# EAGLE schematic ramanSpectrometer_contolBoard (EAGLE 6.2)
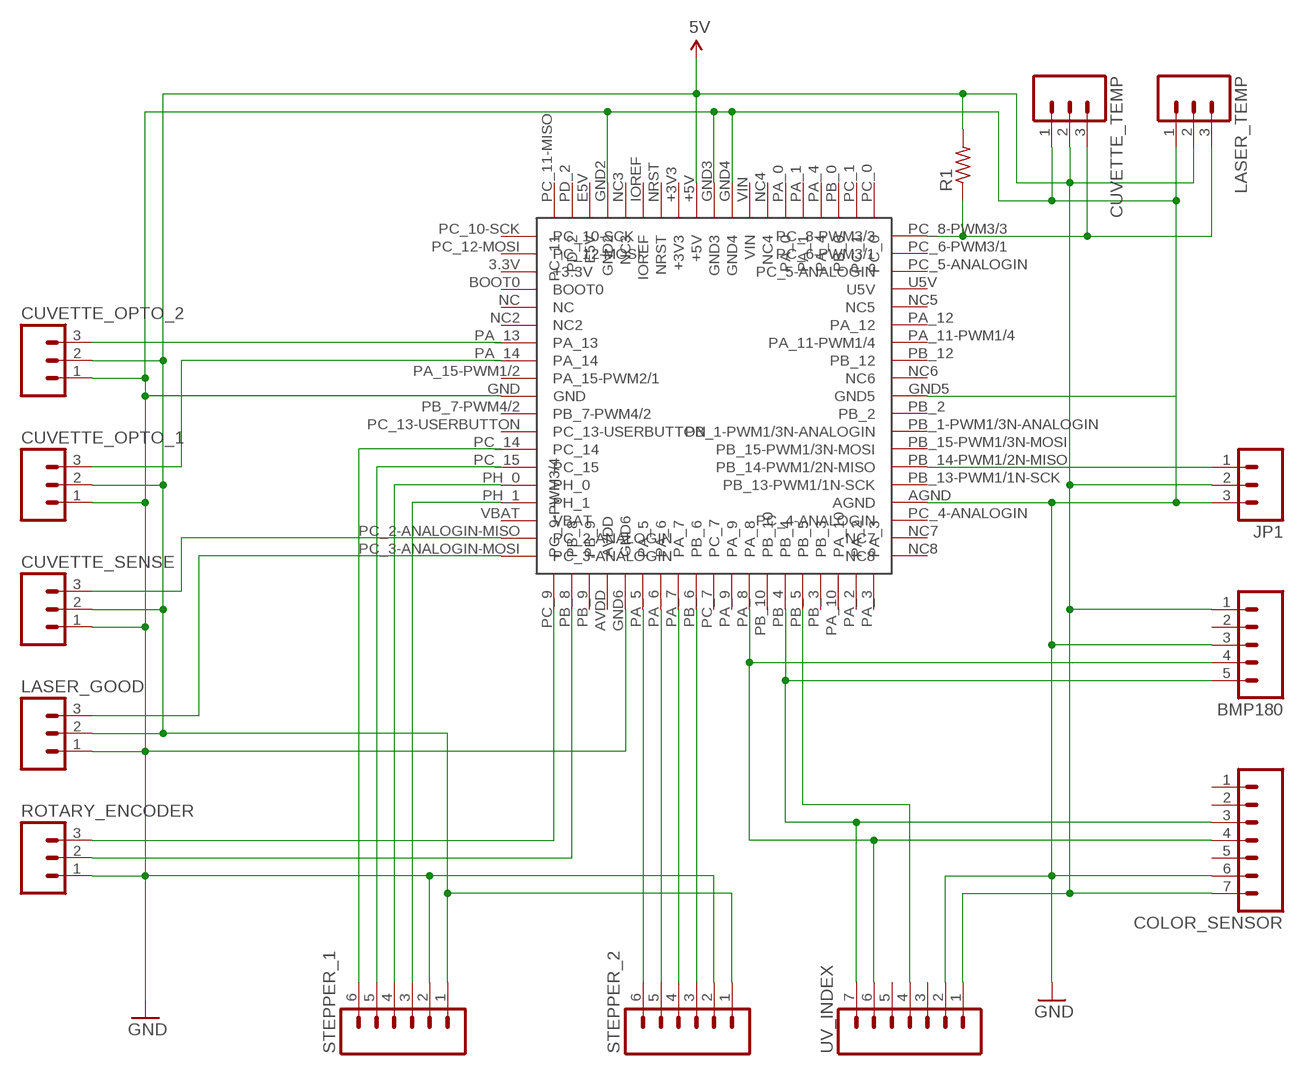
[diagram p0: schematic, sheet 1]

## Parts
BMP180  M05PTH  [1X05]
COLOR_SENSOR  M07  [1X07]
CUVETTE_OPTO_1  M03JST-PTH-VERT  [JST-3-PTH-VERT]
CUVETTE_OPTO_2  M03JST-PTH-VERT  [JST-3-PTH-VERT]
CUVETTE_SENSE  M03JST-PTH-VERT  [JST-3-PTH-VERT]
CUVETTE_TEMP  M03JST-PTH-VERT  [JST-3-PTH-VERT]
JP1  M03PTH  [1X03]
LASER_GOOD  M03JST-PTH-VERT  [JST-3-PTH-VERT]
LASER_TEMP  M03JST-PTH-VERT  [JST-3-PTH-VERT]
R1  R-US_M1206  [M1206]
ROTARY_ENCODER  M03JST-PTH-VERT  [JST-3-PTH-VERT]
STEPPER_1  M06SIP  [1X06]
STEPPER_2  M06SIP  [1X06]
U$1  STNUCLEOF401RE  [F401-RE]
UV_INDEX  M07  [1X07]

## Nets
5V: BMP180.1 COLOR_SENSOR.7 CUVETTE_OPTO_1.2 CUVETTE_OPTO_2.2 CUVETTE_SENSE.2 CUVETTE_TEMP.2 JP1.2 LASER_GOOD.2 LASER_TEMP.2 R1.2 STEPPER_1.1 STEPPER_2.1 U$1.+5V UV_INDEX.1
GND: BMP180.3 COLOR_SENSOR.6 CUVETTE_OPTO_1.1 CUVETTE_OPTO_2.1 CUVETTE_SENSE.1 CUVETTE_TEMP.1 JP1.3 LASER_GOOD.1 LASER_TEMP.1 ROTARY_ENCODER.1 STEPPER_1.2 STEPPER_2.2 U$1.AGND U$1.GND U$1.GND2 U$1.GND3 U$1.GND4 U$1.GND5 U$1.GND6 UV_INDEX.2
N$1: ROTARY_ENCODER.2 U$1.PB_8
N$2: JP1.1 U$1.PB_14-PWM1/2N-MISO
N$3: CUVETTE_OPTO_2.3 U$1.PA_13
N$4: CUVETTE_OPTO_1.3 U$1.PA_14
N$5: CUVETTE_SENSE.3 U$1.PC_2-ANALOGIN-MISO(PC_2-ANALOGIN)
N$6: LASER_GOOD.3 U$1.PC_3-ANALOGIN-MOSI(PC_3-ANALOGIN)
N$7: CUVETTE_TEMP.3 LASER_TEMP.3 R1.1 U$1.PC_8-PWM3/3
N$8: ROTARY_ENCODER.3 U$1.PC_9(PC_9-PWM3/4)
N$9: STEPPER_1.6 U$1.PC_14
N$10: STEPPER_1.5 U$1.PC_15
N$11: STEPPER_1.4 U$1.PH_0
N$12: STEPPER_1.3 U$1.PH_1
N$13: STEPPER_2.6 U$1.PA_5
N$14: STEPPER_2.5 U$1.PA_6
N$15: STEPPER_2.4 U$1.PA_7
N$16: STEPPER_2.3 U$1.PB_6
N$17: BMP180.5 COLOR_SENSOR.3 U$1.PB_4 UV_INDEX.7
N$18: BMP180.4 COLOR_SENSOR.4 U$1.PA_8 UV_INDEX.6
N$20: U$1.PB_5 UV_INDEX.4
Unconnected: BMP180.2 COLOR_SENSOR.1 COLOR_SENSOR.2 COLOR_SENSOR.5 U$1.+3V3 U$1.BOOT0 U$1.IOREF U$1.NC U$1.NC2 U$1.NC3 U$1.NC4 U$1.NC5 U$1.NC7 U$1.NC8 U$1.NRST U$1.PA_0 U$1.PA_1 U$1.PA_2 U$1.PA_3 U$1.PA_4 U$1.PA_9 U$1.PA_10 U$1.PA_11-PWM1/4 U$1.PA_12 U$1.PA_15-PWM1/2(PA_15-PWM2/1) U$1.PB_0 U$1.PB_1-PWM1/3N-ANALOGIN U$1.PB_2 U$1.PB_3 U$1.PB_7-PWM4/2 U$1.PB_9 U$1.PB_10 U$1.PB_12 U$1.PB_13-PWM1/1N-SCK U$1.PB_15-PWM1/3N-MOSI U$1.PC_0 U$1.PC_1 U$1.PC_4-ANALOGIN U$1.PC_5-ANALOGIN U$1.PC_6-PWM3/1 U$1.PC_7 U$1.PC_10-SCK U$1.PC_11-MISO(PC_11) U$1.PC_12-MOSI U$1.PC_13-USERBUTTON U$1.PD_2 U$1.U5V U$1.VIN UV_INDEX.3 UV_INDEX.5

## Power pins joined to a net without a drawn wire
+3.3V: U$1.3.3V(+3.3V)
AVDD: U$1.AVDD
E5V: U$1.E5V
NC6: U$1.NC6
VBAT: U$1.VBAT

## Library data of the parts
BMP180 = SparkFun-Connectors:M05: Header 5 Standard 5-pin 0.1" header. Use with straight break away headers (SKU : PRT-00116), right angle break away headers (PRT-00553), swiss pins (PRT-00743), machine pins (PRT-00117), and female headers (PRT-00115). Molex polarized connector foot print use with SKU : PRT-08230 with associated crimp pins and housings.
COLOR_SENSOR UV_INDEX = SparkFun-Connectors:M07: Header 7 Standard 7-pin 0.1" header. Use with straight break away headers (SKU : PRT-00116), right angle break away headers (PRT-00553), swiss pins (PRT-00743), machine pins (PRT-00117), and female headers (PRT-00115). NOTES ON THE VARIANTS LOCK and LOCK_LONGPADS... This footprint was designed to help hold the alignment of a through-hole component (i.e. 7-pin header) while soldering it into place. You may notice that each hole has been shifted either up or down by 0.005 of an inch from it's more standard position (which is usually a perfectly straight line). This slight alteration caused the pins (the squares in the middle) to touch the edges of the holes. Because they are alternating, it causes a "brace" to hold the header in place. 0.005 has proven to be the perfect amount of "off-center" position when using our standard breakaway headers. Although looks a little odd when you look at the bare footprint, once you have a header in there, the alteration is very hard to notice. Also, if you push a header all the way into place, it is covered up entirely on the bottom side. This idea of altering the position of holes to aid alignment will be further integrated into the Sparkfun Library for other footprints. It can help hold any component with 3 or more connection pins.
CUVETTE_OPTO_1 CUVETTE_OPTO_2 CUVETTE_SENSE CUVETTE_TEMP JP1 LASER_GOOD LASER_TEMP ROTARY_ENCODER = SparkFun-Connectors:M03: Header 3 Standard 3-pin 0.1" header. Use with straight break away headers (SKU : PRT-00116), right angle break away headers (PRT-00553), swiss pins (PRT-00743), machine pins (PRT-00117), and female headers (PRT-00115). Molex polarized connector foot print use with SKU : PRT-08232 with associated crimp pins and housings.
R1 = adafruit:R-US_: RESISTOR, American symbol
STEPPER_1 STEPPER_2 = SparkFun-Connectors:M06: Header 6 Standard 6-pin 0.1" header. Use with straight break away headers (SKU : PRT-00116), right angle break away headers (PRT-00553), swiss pins (PRT-00743), machine pins (PRT-00117), and female headers (PRT-00115). Molex polarized connector foot print use with SKU : PRT-08094 with associated crimp pins and housings. NOTES ON THE VARIANTS LOCK and LOCK_LONGPADS... This footprint was designed to help hold the alignment of a through-hole component (i.e. 6-pin header) while soldering it into place. You may notice that each hole has been shifted either up or down by 0.005 of an inch from it's more standard position (which is a perfectly straight line). This slight alteration caused the pins (the squares in the middle) to touch the edges of the holes. Because they are alternating, it causes a "brace" to hold the component in place. 0.005 has proven to be the perfect amount of "off-center" position when using our standard breakaway headers. Although looks a little odd when you look at the bare footprint, once you have a header in there, the alteration is very hard to notice. Also,if you push a header all the way into place, it is covered up entirely on the bottom side. This idea of altering the position of holes to aid alignment will be further integrated into the Sparkfun Library for other footprints. It can help hold any component with 3 or more connection pins.
U$1 = nucleoF401RE:STNUCLEOF401RE